# EAGLE design Insperino - Ver. 1.0 (EAGLE 8.6.0)
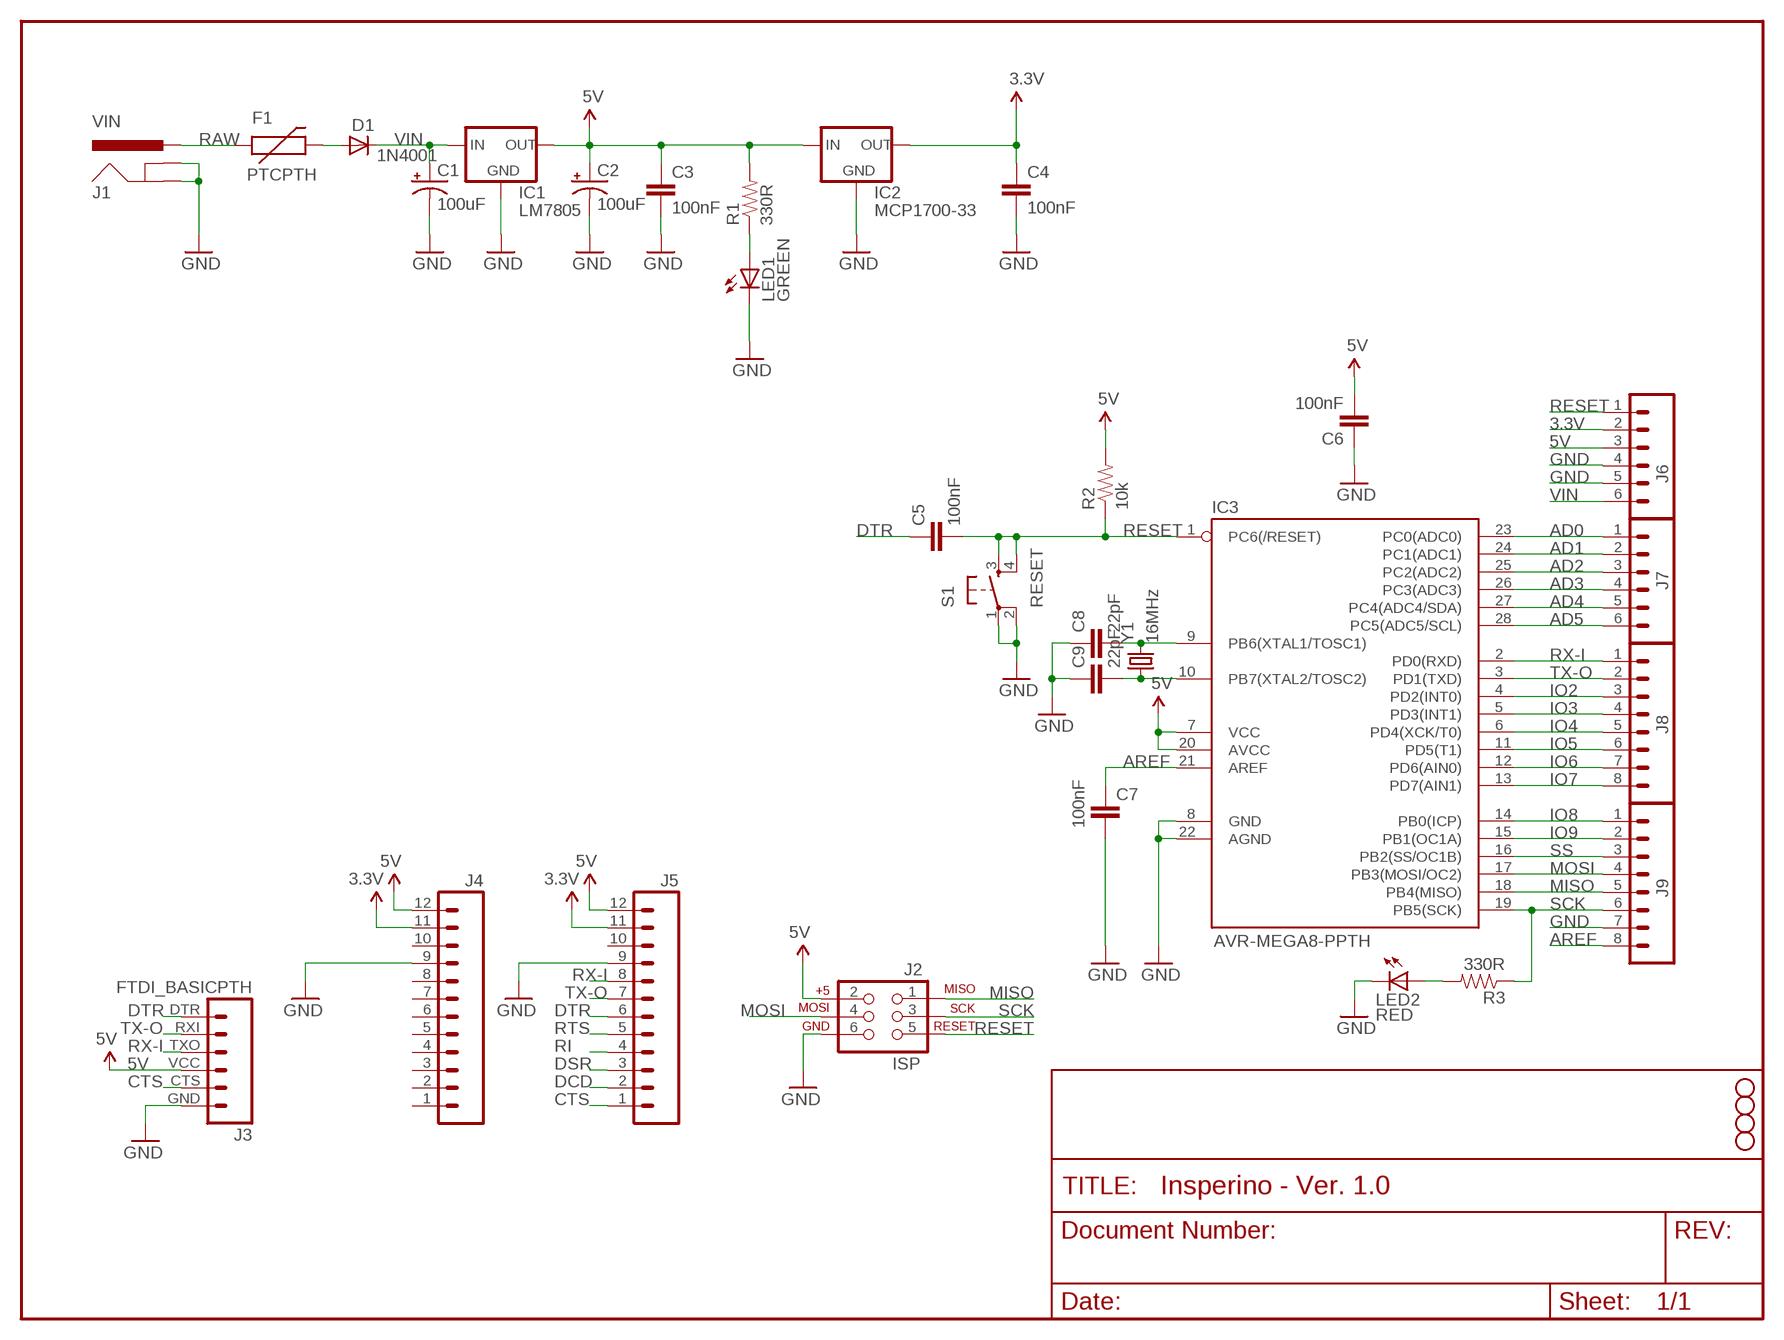
[diagram p0: schematic, sheet 1]

## Parts
C1  100uF  CAP_POLPTH1  [CPOL-RADIAL-100UF-25V]
C2  100uF  CAP_POLPTH1  [CPOL-RADIAL-100UF-25V]
C3  100nF  CAPPTH2  [CAP-PTH-SMALL2]
C4  100nF  CAPPTH2  [CAP-PTH-SMALL2]
C5  100nF  CAPPTH2  [CAP-PTH-SMALL2]
C6  100nF  CAPPTH2  [CAP-PTH-SMALL2]
C7  100nF  CAPPTH2  [CAP-PTH-SMALL2]
C8  22pF  CAPPTH2  [CAP-PTH-SMALL2]
C9  22pF  CAPPTH2  [CAP-PTH-SMALL2]
D1  1N4001  DIODEPTH  [DIODE-1N4001]
F1  PTCPTH  [PTC]
IC1  LM7805  V_REG_78XX-TO-220  [TO-220-ALT]
IC2  MCP1700-33  V_REG_78XXTO-92  [TO-92]
IC3  AVR-MEGA8-PPTH  [DIL28-3]
J1  VIN  POWER_JACKPTH_LOCK  [POWER_JACK_PTH_LOCK]
J2  ISP  AVR_SPI_PRG_6PTH  [2X3]
J3  FTDI_BASICPTH  [FTDI_BASIC]
J4  M12PTH  [1X12]
J5  M12PTH  [1X12]
J6  M06SIP  [1X06]
J7  M06SIP  [1X06]
J8  M081X08  [1X08]
J9  M081X08  [1X08]
JP3  STAND-OFF  [STAND-OFF]
JP4  STAND-OFF  [STAND-OFF]
JP5  STAND-OFF  [STAND-OFF]
JP6  STAND-OFF  [STAND-OFF]
LED1  GREEN  LED5MM  [LED5MM]
LED2  RED  LED5MM  [LED5MM]
R1  330R  RESISTORAXIAL-0.3  [AXIAL-0.3]
R2  10k  RESISTORAXIAL-0.3  [AXIAL-0.3]
R3  330R  RESISTORAXIAL-0.3  [AXIAL-0.3]
S1  RESET  TAC_SWITCHPTH  [TACTILE-PTH]
Y1  16MHz  CRYSTALHC49US  [HC49US]

## Nets
3.3V: C4.1 IC2.3(OUT) J4.11 J5.11 J6.2
5V: C2.1(+) C3.1 C6.2 IC1.OUT IC2.2(IN) IC3.7(VCC) IC3.20(AVCC) J2.2 J3.VCC J4.12 J5.12 J6.3 R1.P$2 R2.P$2
AD0: IC3.23(PC0(ADC0)) J7.1
AD1: IC3.24(PC1(ADC1)) J7.2
AD2: IC3.25(PC2(ADC2)) J7.3
AD3: IC3.26(PC3(ADC3)) J7.4
AD4: IC3.27(PC4(ADC4/SDA)) J7.5
AD5: IC3.28(PC5(ADC5/SCL)) J7.6
AREF: C7.1 IC3.21(AREF) J9.8
CTS: J3.CTS J5.1
DCD: J5.2
DSR: J5.3
DTR: C5.1 J3.DTR J5.6
GND: C1.2(-) C2.2(-) C3.2 C4.2 C6.1 C7.2 C8.1 C9.1 IC1.GND IC2.1(GND) IC3.8(GND) IC3.22(AGND) J1.GND J1.GNDBREAK J2.6 J3.GND J4.9 J5.9 J6.4 J6.5 J9.7 LED1.K(C) LED2.K(C) S1.1 S1.2
IO2: IC3.4(PD2(INT0)) J8.3
IO3: IC3.5(PD3(INT1)) J8.4
IO4: IC3.6(PD4(XCK/T0)) J8.5
IO5: IC3.11(PD5(T1)) J8.6
IO6: IC3.12(PD6(AIN0)) J8.7
IO7: IC3.13(PD7(AIN1)) J8.8
IO8: IC3.14(PB0(ICP)) J9.1
IO9: IC3.15(PB1(OC1A)) J9.2
MISO: IC3.18(PB4(MISO)) J2.1 J9.5
MOSI: IC3.17(PB3(MOSI/OC2)) J2.4 J9.4
N$1: LED2.A R3.P$2
N$2: LED1.A R1.P$1
N$3: C8.2 IC3.9(PB6(XTAL1/TOSC1)) Y1.2
N$4: C9.2 IC3.10(PB7(XTAL2/TOSC2)) Y1.1
N$6: D1.A F1.P$2
RAW: F1.P$1 J1.PWR
RESET: C5.2 IC3.1(PC6(/RESET)) J2.5 J6.1 R2.P$1 S1.3 S1.4
RI: J5.4
RTS: J5.5
RX-I: IC3.2(PD0(RXD)) J3.TXO J5.8 J8.1
SCK: IC3.19(PB5(SCK)) J2.3 J9.6 R3.P$1
SS: IC3.16(PB2(SS/OC1B)) J9.3
TX-O: IC3.3(PD1(TXD)) J3.RXI J5.7 J8.2
VIN: C1.1(+) D1.C IC1.IN J6.6
Unconnected: J4.1 J4.2 J4.3 J4.4 J4.5 J4.6 J4.7 J4.8 J4.10 J5.10

## Library data of the parts
C1 C2 = SparkFun:CAP_POL: Capacitor Polarized These are standard SMD and PTH capacitors. Normally 10uF, 47uF, and 100uF in electrolytic and tantalum varieties. Always verify the external diameter of the through hole cap, it varies with capacity, voltage, and manufacturer. The EIA devices should be standard.
C3-C9 = SparkFun:CAP: Capacitor Standard 0603 ceramic capacitor, and 0.1" leaded capacitor.
D1 = SparkFun:DIODE: Diode These are standard reverse protection diodes and small signal diodes. SMA package can handle up to about 1A. SOD-323 can handle about 200mA. What the SOD-323 package when ordering, there are some mfgs out there that are 5-pin packages.
F1 = SparkFun:PTC: Resettable Fuse PTC Resettable Fuse. Spark Fun Electronics SKU : COM-08357
IC1 IC2 = SparkFun:V_REG_78XX: Voltage Regulator Standard 7805 5V regulator. IGO (Input Ground Output). Spark Fun Electronics SKU : COM-00107
IC3 = SparkFun:AVR-MEGA8-P: MICROCONTROLLER 8 Kbytes FLASH 1 kbytes SRAM 512 bytes EEPROM USART 4-channel 10 bit ADC 2-channel 8 bit ADC
J1 = SparkFun:POWER_JACK: Power Jack This is the standard 5.5mm barrel jack for power. The PTH is the most common, proven, reliable, footprint. All others are experimental. The Slot footprint only works if the mill layer is transmitted to the PCB fab house so be warned. Spark Fun Electronics SKU : PRT-00119. Mating wall wart : TOL-00298 (and others)
J2 = SparkFun:AVR_SPI_PRG_6: AVR ISP 6 Pin This is the reduced ISP connector for AVR programming. Common on Arduino. This footprint will take up less PCB space and can be used with a 10-pin to 6-pin adapter such as SKU: BOB-08508
J3 = SparkFun-Connectors:FTDI_BASIC: FTDI Basic header with labels
J4 J5 = SparkFun-Connectors:M12: Header 12 Standard 12-pin 0.1" header. Use with straight break away headers (SKU : PRT-00116), right angle break away headers (PRT-00553), swiss pins (PRT-00743), machine pins (PRT-00117), and female headers (PRT-00115).
J6 J7 = SparkFun:M06: Header 6 Standard 6-pin 0.1" header. Use with straight break away headers (SKU : PRT-00116), right angle break away headers (PRT-00553), swiss pins (PRT-00743), machine pins (PRT-00117), and female headers (PRT-00115). Molex polarized connector foot print use with SKU : PRT-08094 with associated crimp pins and housings. NOTES ON THE VARIANTS LOCK and LOCK_LONGPADS... This footprint was designed to help hold the alignment of a through-hole component (i.e. 6-pin header) while soldering it into place. You may notice that each hole has been shifted either up or down by 0.005 of an inch from it's more standard position (which is a perfectly straight line). This slight alteration caused the pins (the squares in the middle) to touch the edges of the holes. Because they are alternating, it causes a "brace" to hold the component in place. 0.005 has proven to be the perfect amount of "off-center" position when using our standard breakaway headers. Although looks a little odd when you look at the bare footprint, once you have a header in there, the alteration is very hard to notice. Also, if you push a header all the way into place, it is covered up entirely on the bottom side. This idea of altering the position of holes to aid alignment will be further integrated into the Sparkfun Library for other footprints. It can help hold any component with 3 or more connection pins.
J8 J9 = SparkFun:M08: Header 8 Standard 8-pin 0.1" header. Use with straight break away headers (SKU : PRT-00116), right angle break away headers (PRT-00553), swiss pins (PRT-00743), machine pins (PRT-00117), and female headers (PRT-00115).
JP3-JP6 = SparkFun:STAND-OFF: Stand Off This is the mechanical footprint for a #4 phillips button head screw. Use the keepout ring to avoid running the screw head into surrounding components. SKU : PRT-00447
LED1 LED2 = SparkFun:LED: LEDs Standard schematic elements and footprints for 5mm, 3mm, 1206, and 0603 sized LEDs. 5mm - Spark Fun Electronics SKU : COM-00529 (and others)
R1-R3 = SparkFun:RESISTOR: Resistor Basic schematic elements and footprints for 0603, 1206, and PTH resistors.
S1 = SparkFun:TAC_SWITCH: Momentary Switch Button commonly used for reset or general input. Spark Fun Electronics SKU : COM-00097
Y1 = SparkFun:CRYSTAL: Crystals Various standard crystals. Proven footprints. Spark Fun Electronics SKU : COM-00534

## Board
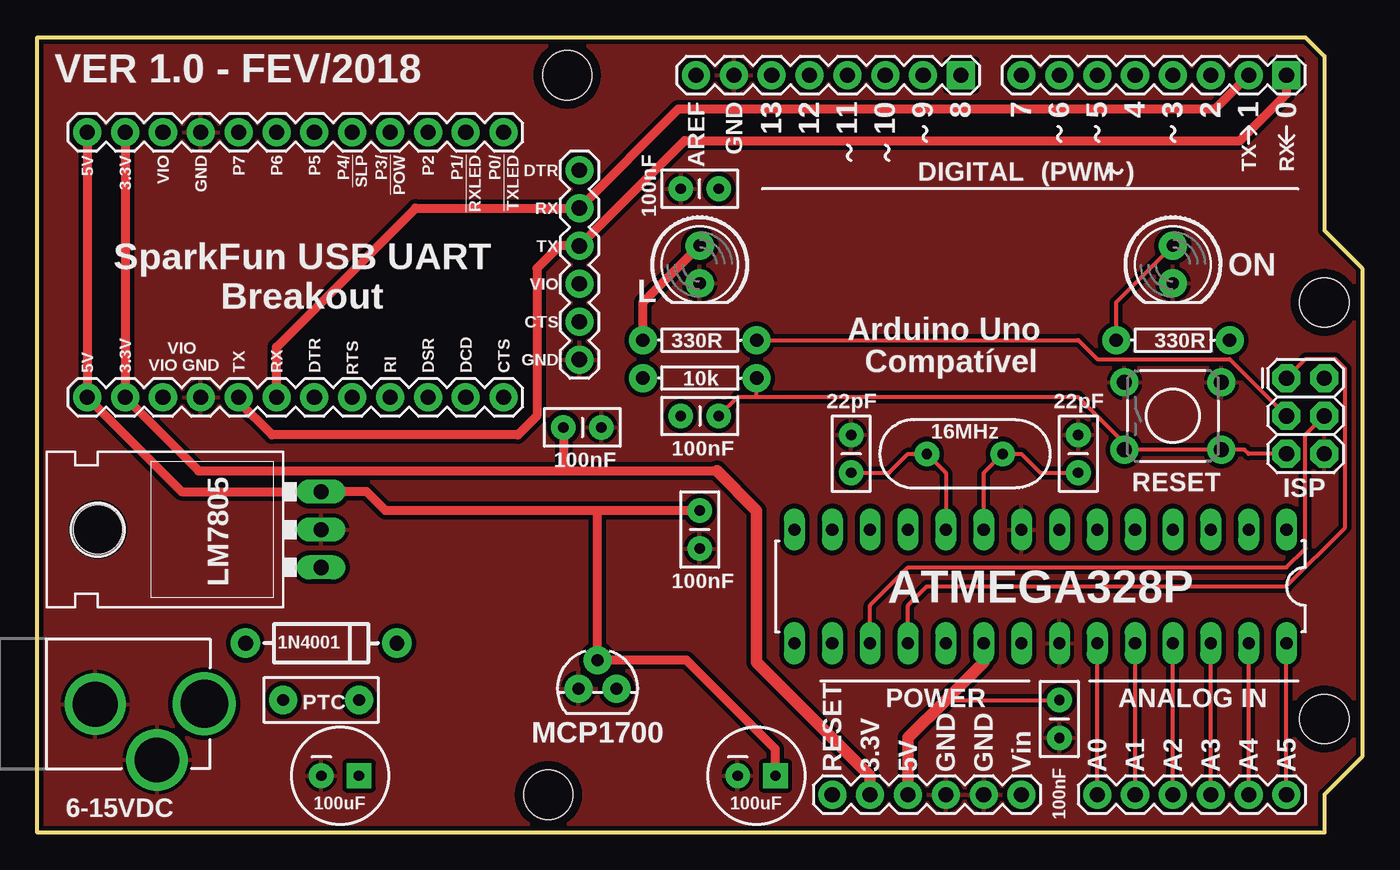
[diagram p1: board, top side]
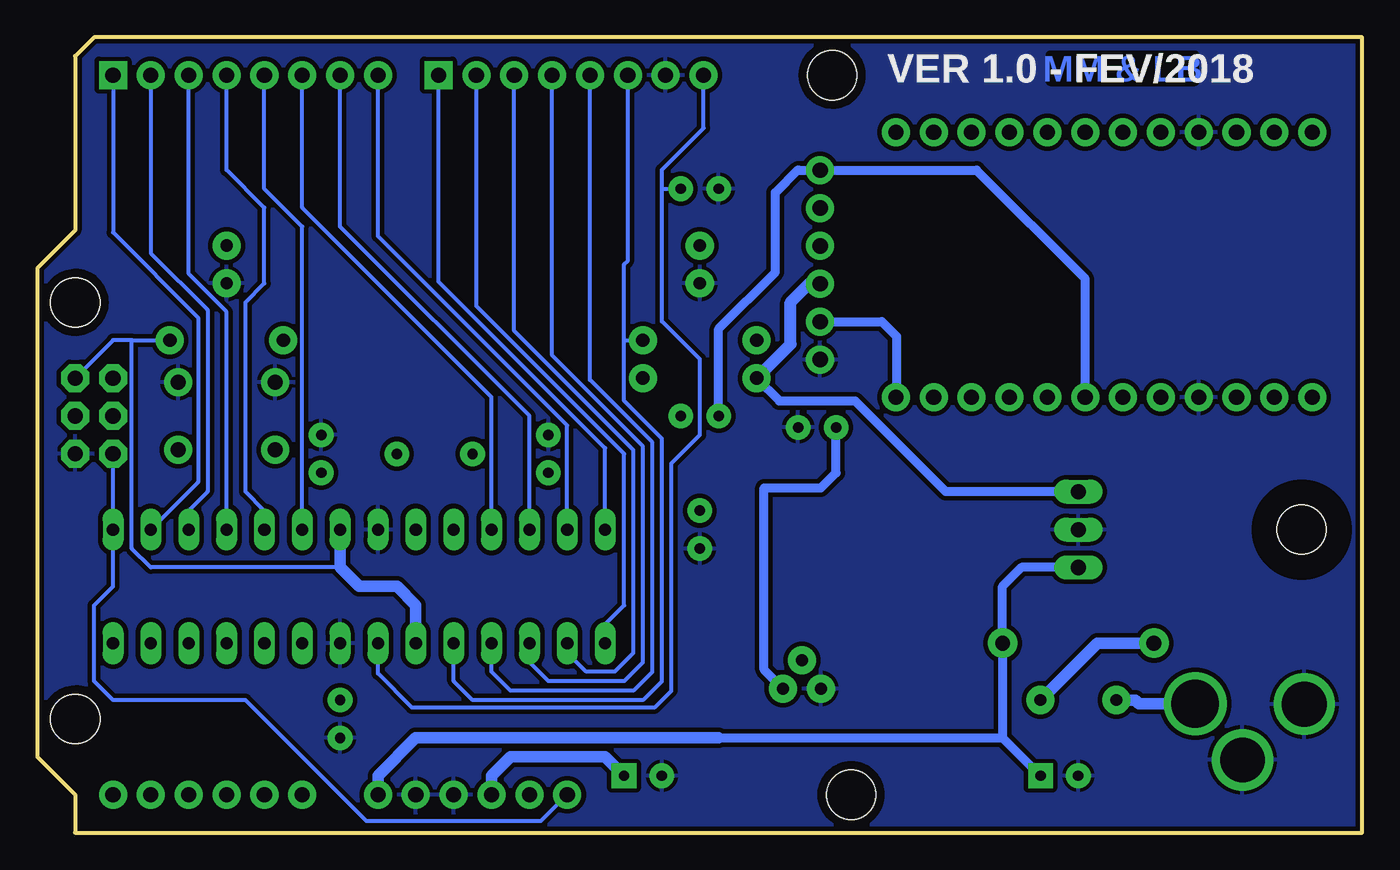
[diagram p2: board, bottom side, seen from below]

Size 88.9 x 53.34 mm. Coordinates in mm from the lower left corner, seen from the top.
Outline: 0,53.34 85.09,53.34 86.36,52.07 86.36,40.39 88.9,37.85 88.9,5.08 86.36,2.54 86.36,0 0,0 0,53.34
Copper layers (1*16): Top 0.035mm / dielectric 1.5mm / Bottom 0.035mm
Design rules "SparkFun *": minimum track width 8mil, minimum drill 20mil, track to track 8mil, track to pad 8mil, pad to pad 8mil, via to via 8mil, smd to smd 8mil, copper to edge 8mil, drill to drill 8mil, minimum pad ring 12mil, minimum via ring 10mil, stop-mask expansion 4mil, vias tented up to drill 20mil, thermal gap 10mil

### Footprints (pad centres in the part's own frame; a part is rotated, then mirrored left to right if it is on the bottom)
CPOL-RADIAL-100UF-25V = drill 0.7 pad 1.651 square: 1 1.27,0 | drill 0.7 pad 1.651: 2 -1.27,0
CAP-PTH-SMALL2 = drill 0.7 pad 1.651: 1 0,0; 2 2.54,0
DIODE-1N4001 = drill 1 pad 1.981: A -5.08,0; C 5.08,0
PTC = drill 0.8 pad 1.88: P$1 -2.54,0; P$2 2.54,0
TO-220-ALT = drill 1.016 long: GND 0,-3.81; IN -2.54,-3.81; OUT 2.54,-3.81 | hole 3.302: 0,11.176
TO-92 = drill 0.813 pad 1.88: 1 -1.27,0; 2 0,1.905; 3 1.27,0
DIL28-3 = drill 0.813 long: 1 -16.51,-3.81; 2 -13.97,-3.81; 3 -11.43,-3.81; 4 -8.89,-3.81; 5 -6.35,-3.81; 6 -3.81,-3.81; 7 -1.27,-3.81; 8 1.27,-3.81; 9 3.81,-3.81; 10 6.35,-3.81; 11 8.89,-3.81; 12 11.43,-3.81; 13 13.97,-3.81; 14 16.51,-3.81; 15 16.51,3.81; 16 13.97,3.81; 17 11.43,3.81; 18 8.89,3.81; 19 6.35,3.81; 20 3.81,3.81; 21 1.27,3.81; 22 -1.27,3.81; 23 -3.81,3.81; 24 -6.35,3.81; 25 -8.89,3.81; 26 -11.43,3.81; 27 -13.97,3.81; 28 -16.51,3.81
POWER_JACK_PTH_LOCK = drill 2.997 pad 4.115: GND 0.025,6.557; GNDBREAK 3.762,10.7 | drill 3.2 pad 4.115: PWR 0,13.878
2X3 = drill 1.016 pad 1.88 octagon: 1 0,0; 2 0,2.54; 3 2.54,0; 4 2.54,2.54; 5 5.08,0; 6 5.08,2.54
FTDI_BASIC = drill 1.016 pad 1.88: CTS 10.16,0; DTR 0,0; GND 12.7,0; RXI 2.54,0; TXO 5.08,0; VCC 7.62,0
1X12 = drill 1.016 pad 1.88: 1 0,0; 2 2.54,0; 3 5.08,0; 4 7.62,0; 5 10.16,0; 6 12.7,0; 7 15.24,0; 8 17.78,0; 9 20.32,0; 10 22.86,0; 11 25.4,0; 12 27.94,0
1X06 = drill 1.016 pad 1.88: 1 0,0; 2 2.54,0; 3 5.08,0; 4 7.62,0; 5 10.16,0; 6 12.7,0
1X08 = drill 1.016 pad 1.88 square: 1 0,0 | drill 1.016 pad 1.88: 2 2.54,0; 3 5.08,0; 4 7.62,0; 5 10.16,0; 6 12.7,0; 7 15.24,0; 8 17.78,0
STAND-OFF = hole 3.302: 0,0
LED5MM = drill 0.813 pad 1.88: A -1.27,0; K 1.27,0
AXIAL-0.3 = drill 0.9 pad 1.88: P$1 -3.81,0; P$2 3.81,0
TACTILE-PTH = drill 1.016 pad 1.88: 1 -3.251,2.261; 2 3.251,2.261; 3 -3.251,-2.261; 4 3.251,-2.261
HC49US = drill 0.7 pad 1.651: 1 -2.54,0; 2 2.54,0

### Placement (x,y rotation side)
C1  20.32,3.81 0 top
C2  48.26,3.81 0 top
C3  44.45,21.59 270 top
C4  35.31,27.18 0 top
C5  43.18,27.94 0 top
C6  68.58,6.35 90 top
C7  45.72,43.18 180 top
C8  69.85,26.67 270 top
C9  54.61,26.67 270 top
D1  19.05,12.7 0 top
F1  19.05,8.89 0 top
IC1  15.24,20.32 90 top
IC2  37.59,9.65 0 top
IC3  67.31,16.51 180 top
J1  -2.67,8.64 270 top
J2  83.82,30.48 270 top
J3  36.37,44.42 270 top
J4  31.29,46.96 180 top
J5  31.29,29.18 180 top
J6  53.34,2.54 0 top
J7  71.12,2.54 0 top
J8  83.82,50.8 180 top
J9  61.98,50.8 180 top
JP3  34.29,2.54 0 top
JP4  86.36,7.62 0 top
JP5  86.36,35.56 0 top
JP6  35.56,50.8 0 top
LED1  76.2,38.1 270 top
LED2  44.45,38.1 270 top
R1  76.2,33.02 0 top
R2  44.45,30.48 180 top
R3  44.45,33.02 180 top
S1  76.2,27.94 0 top
Y1  62.23,25.4 0 top

### Tracks (layer width: path | path; a pad name or v marks a point on that pad's centre or on a via)
3.3V
  Top 0.61: J4.11 J5.11 10.82,24.26 35.31,24.26 | 35.31,24.26 45.59,24.26 | C4.1 35.31,24.26
  Top 0.762: J6.2 55.88,3.81 48.26,11.43 48.26,21.59 45.59,24.26
  Bottom 0.61: IC2.3 40.13,10.92 40.13,23.11 36.32,23.11 35.31,24.13 C4.1
5V
  Top 0.254: 60.96,8.89 C6.2
  Top 0.61: 37.59,21.59 23.37,21.59 22.1,22.86 IC1.OUT 9.68,22.86 J5.12 J4.12 | 37.59,21.59 IC2.2 43.56,11.56 49.53,5.59 C2.1 | C3.1 37.59,21.59
  Top 0.762: 20.32,22.86 IC1.OUT | IC3.20 63.5,11.43 60.96,8.89 58.42,6.35 J6.3
  Bottom 0.254: 68.58,17.78 81.28,17.78 82.55,19.05 82.55,33.02 | 82.55,33.02 R1.P$2 | 82.55,33.02 83.82,33.02 J2.2
  Bottom 0.61: IC1.OUT 27.94,22.86 34.04,28.96 39.12,28.96 R2.P$2
  Bottom 0.762: J6.3 58.42,3.81 57.15,5.08 50.8,5.08 C2.1 | IC3.20 63.5,15.24 64.77,16.51 67.31,16.51 68.58,17.78 IC3.7
  Bottom 0.813: R2.P$2 38.35,32.77 38.35,35.56 37.08,36.83 37.06,36.8 J3.VCC
AD0
  Top 0.254: J7.1 IC3.23
AD1
  Top 0.254: J7.2 IC3.24
AD2
  Top 0.254: J7.3 IC3.25
AD3
  Top 0.254: J7.4 IC3.26
AD4
  Top 0.254: J7.5 IC3.27
AD5
  Top 0.254: J7.6 IC3.28
AREF
  Bottom 0.254: IC3.21 66.04,10.67 63.75,8.38 47.5,8.38 46.35,9.53 46.35,24.77 44.45,26.67 44.45,31.75 46.99,34.29 46.99,43.18 | J9.8 44.2,47.24 46.99,44.45 46.99,43.18 | 46.99,43.18 C7.1
CTS
  Bottom 0.61: J3.CTS 32.23,34.27 31.24,33.27 31.24,29.23 J5.1
DTR
  Bottom 0.61: J5.6 18.59,37.13 25.88,44.42 J3.DTR 37.82,44.42 37.85,44.45 39.37,42.93 39.37,37.59 43.18,33.78 C5.1
GND
  pour Bottom (isolate 0.305): 0,53.34 0,0 86.36,0 86.36,2.54 88.9,5.08 88.9,38.1 86.36,40.64 86.36,52.07 85.09,53.34
  pour Top (isolate 0.305): 0,53.34 0,0 86.36,0 86.36,2.54 88.9,5.08 88.9,38.1 86.36,40.64 86.36,52.07 85.09,53.34
IO2
  Bottom 0.254: IC3.4 76.2,34.92 78.74,37.47 J8.3
IO3
  Bottom 0.254: IC3.5 73.66,21.59 74.93,22.86 74.93,35.56 73.66,36.83 73.66,41.91 76.2,44.45 J8.4
IO4
  Bottom 0.254: IC3.6 71.12,40.64 73.66,43.18 J8.5
IO5
  Bottom 0.254: J8.6 71.12,41.91 58.42,29.21 IC3.11
IO6
  Bottom 0.254: J8.7 68.58,40.64 55.88,27.94 IC3.12
IO7
  Bottom 0.254: J8.8 66.04,40.01 53.34,27.3 IC3.13
IO8
  Bottom 0.254: IC3.14 50.8,25.78 61.98,36.96 J9.1
IO9
  Bottom 0.254: IC3.15 50.8,13.97 49.53,15.24 49.53,25.4 59.44,35.31 J9.2
MISO
  Top 0.254: J2.1 85.09,31.75 87.12,31.75 87.76,31.11 87.76,20.45 83.82,16.51 59.69,16.51 58.42,15.24 IC3.18
  Bottom 0.254: IC3.18 58.42,10.79 57.15,9.53 48.89,9.53 47.62,10.79 47.62,26.16 51.82,30.35 J9.5
MOSI
  Top 0.254: IC3.17 55.88,15.24 58.42,17.78 83.82,17.78 85.09,19.05 85.09,26.67 J2.4
  Bottom 0.254: J9.4 54.36,32 48.26,25.91 48.26,11.43 49.53,10.16 54.61,10.16 55.88,11.43 IC3.17
N$1
  Top 0.61: R3.P$2 40.64,35.56 LED2.A
N$2
  Top 0.254: R1.P$1 72.39,35.56 LED1.A
N$3
  Top 0.254: IC3.9 63.5,24.13 Y1.2 66.04,25.4 67.31,24.13 C8.2
N$4
  Top 0.254: IC3.10 60.96,24.13 Y1.1 58.42,25.4 57.15,24.13 C9.2
N$6
  Bottom 0.762: D1.A 17.78,12.7 F1.P$2
RAW
  Bottom 0.762: J1.PWR 14.99,8.64 15.24,8.89 F1.P$1
RESET
  Top 0.254: 48.26,29.21 R2.P$1 | J2.5 81.28,25.4 81,25.68 S1.4 S1.3 72.95,26.11 69.85,29.21 48.26,29.21 | 48.26,29.21 46.99,29.21 C5.2
  Bottom 0.254: J6.1 55.12,0.76 66.8,0.76 74.93,8.89 83.82,8.89 85.09,10.16 85.09,15.24 83.82,16.51 IC3.1 J2.5
RX-I
  Top 0.61: J5.8 13.51,29.01 13.46,28.96 15.75,26.67 32.26,26.67 33.53,27.94 33.53,37.85 35.03,39.34 J3.TXO 43.43,46.41 80.7,46.41 83.82,49.53 J8.1
  Bottom 0.254: J8.1 83.82,40.26 78.11,34.54 78.11,23.5 IC3.2
SCK
  Top 0.254: J2.3 80.01,31.75 71.12,31.75 69.85,33.02 R3.P$1
  Bottom 0.254: IC3.19 60.96,10.16 59.69,8.89 48.26,8.89 46.99,10.16 46.99,26.42 49.53,28.96 49.53,33.02 | J9.6 49.28,38.35 49.53,38.1 49.53,33.02 | 49.53,33.02 R3.P$1
SS
  Bottom 0.254: J9.3 56.9,33.66 48.89,25.65 48.89,12.06 50.16,10.79 52.07,10.79 53.34,12.06 IC3.16
TX-O
  Top 0.61: J5.7 16.05,32.56 25.38,41.88 J3.RXI 43,48.51 78.99,48.51 J8.2
  Bottom 0.254: IC3.3 78.74,21.59 77.47,22.86 77.47,35.05 81.28,38.86 J8.2
VIN
  Bottom 0.61: 24.13,6.35 D1.C 24.13,16.51 22.86,17.78 IC1.IN | 24.13,6.35 C1.1 | 43.94,6.35 24.13,6.35
  Bottom 0.762: J6.6 66.04,3.81 63.5,6.35 43.94,6.35 43.18,6.35

### Text on the board
Bottom: MM & LB
tPlace: VER 1.0 - FEV/2018 | AREF | GND | 13 | 12 | 11 | 10 | 9 | 8 | 7 | 6 | 5 | 4 | 3 | 2 | 1 | 0 | 5V | 3.3V | VIO | GND | P7 | P6 | P5 | P4/ / !SLP | P3/ / !POW | P2 | P1/ / !RXLED | P0/ / !TXLED | DTR | DIGITAL | (PWM | ) | TX | RX | RX | 100nF | TX | SparkFun USB UART / Breakout | VIO | ON | L | CTS | Arduino Uno | VIO | GND | 5V | 3.3V | VIO | GND | TX | RX | DTR | RTS | RI | DSR | DCD | CTS | Compatível | 22pF | 22pF | 100nF | 16MHz | 100nF | RESET | ISP | LM7805 | ATMEGA328P | 100nF | 1N4001 | PTC | POWER | ANALOG IN | MCP1700 | RESET | 3.3V | 5V | GND | GND | Vin | A0 | A1 | A2 | A3 | A4 | A5 | 100uF | 100uF | 6-15VDC | 100nF
bPlace: VER 1.0 - FEV/2018
tFinish: ino
bFinish: ino